# Altium project TEZ_Project.PrjPcb
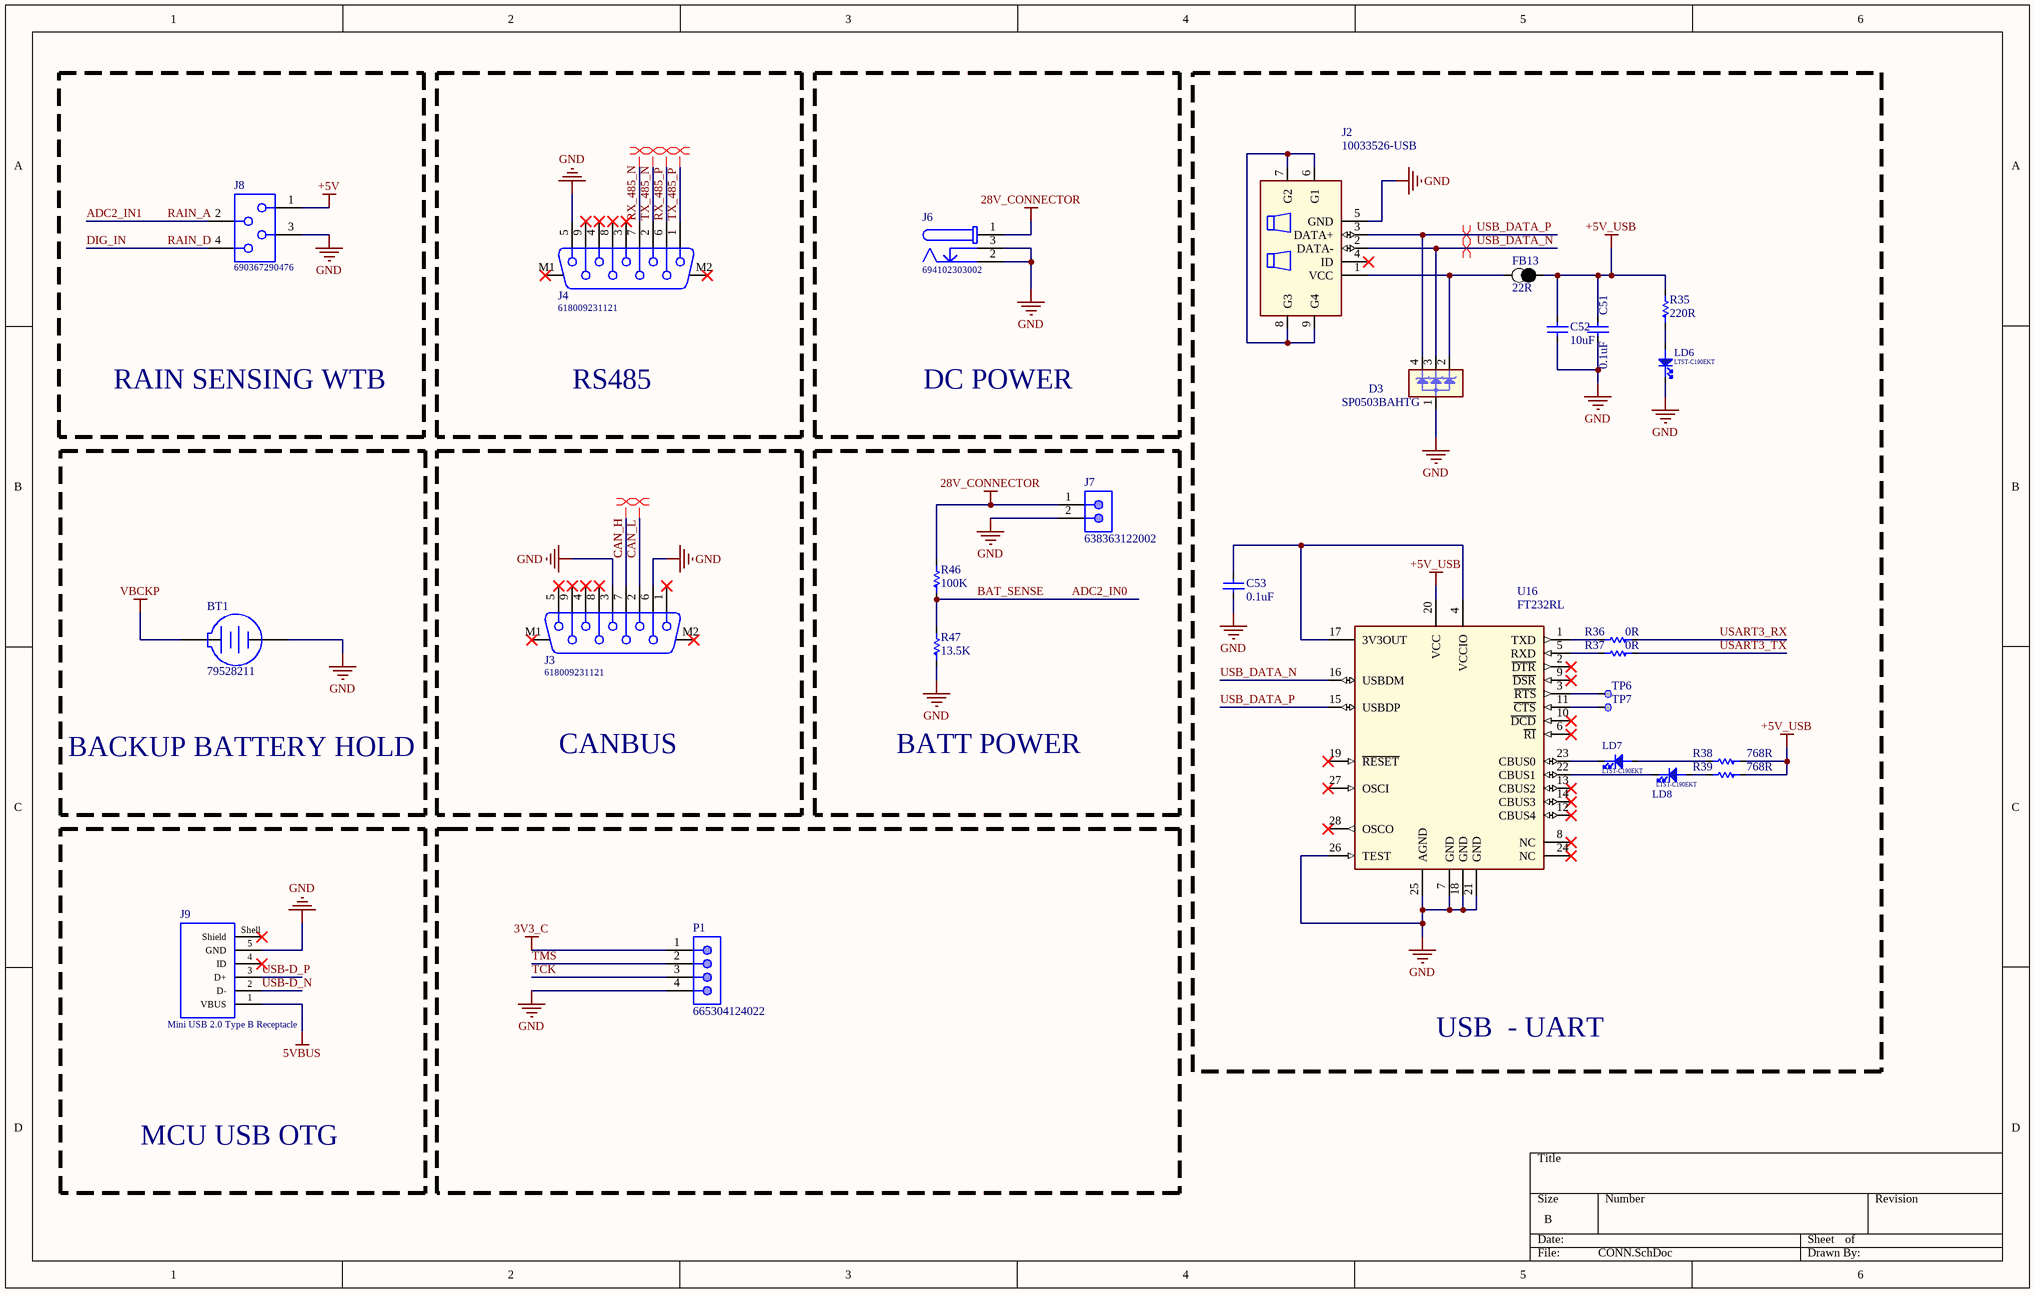
[diagram p0: CONN.SchDoc]
2 sheets, 69 parts. Net scope: global (net labels, ports and power ports of the same name join across sheets).
Board file: TEZ_Project.PcbDoc
Sheets:
  CONN.SchDoc
  DIGITALS.SchDoc

## Sheet CONN.SchDoc
size B; SheetNumber: 4; SheetTotal: 5

### Parts
BT1  79528211  [79528211]
C51  0.1uF  [CAPC1608-0603X85N]
C52  10uF  [CAPC3216-1206X100N]
C53  0.1uF  [CAPC1608-0603X85N]
D3  SP0503BAHTG  [SOT143N]
FB13  22R  [INDC2012-0805X90N]
J2  10033526-USB  [USB/SM0.8-6H5]
J3  618009231121  [618009231121]
J4  618009231121  [618009231121]
J6  694102303002  [694102303002]
J7  638363122002  [638363122002]
J8  690367290476  [690367290476]
J9  Mini USB 2.0 Type B Receptacle  [614105150721]
LD6  LTST-C190EKT  [LED0603-1608X55N-RED]
LD7  LTST-C190EKT  [LED0603-1608X55N-RED]
LD8  LTST-C190EKT  [LED0603-1608X55N-RED]
P1  665304124022  [665304124022]
R35  220R  [RESC1608-0603X50N]
R36  0R  [RESC1608-0603X50N]
R37  0R  [RESC1608-0603X50N]
R38  768R  [RESC2012-0805X50N]
R39  768R  [RESC2012-0805X50N]
R46  100K  [RESC1608-0603X50N]
R47  13.5K  [RESC1608-0603X50N]
TP6  TP  [TP-ROUND]  (value not drawn)  (no BOM)
TP7  TP  [TP-ROUND]  (value not drawn)  (no BOM)
U16  FT232RL  [SSOP65P790-28N]

### Blocks framed on the sheet
RAIN SENSING WTB: J8
RS485: J4
DC POWER: J6
USB  - UART: C51-C53 D3 FB13 J2 LD6-LD8 R35-R39 TP6 TP7 U16
BACKUP BATTERY HOLD: BT1
CANBUS: J3
BATT POWER: J7 R46 R47
MCU USB OTG: J9

### Nets
3V3_C: P1.1
5VBUS: J9.1(VBUS)
28V_CONNECTOR: J6.1 J7.1 R46.2
+5V: J8.1
+5V_USB: C51.1 C52.2 FB13.1 R35.2 R38.1 R39.1 U16.20(VCC)
GND: BT1.2(-) C51.2 C52.1 C53.2 D3.1(A) J2.5(GND) J3.3 J3.6 J4.5 J6.2 J6.3 J7.2 J8.3 J9.5(GND) LD6.2 P1.4 R47.1 U16.7(GND) U16.18(GND) U16.21(GND) U16.25(AGND) U16.26(TEST)
VBCKP: BT1.1(+)
ADC2_IN0: R46.1 R47.2  [also labelled BAT_SENSE]
ADC2_IN1: J8.2  [also labelled RAIN_A]
CAN_H: J3.7
CAN_L: J3.2
DIG_IN: J8.4  [also labelled RAIN_D]
RX_485_N: J4.7
RX_485_P: J4.6
TCK: P1.3
TMS: P1.2
TX_485_N: J4.2
TX_485_P: J4.1
USART3_RX: R36.1
USART3_TX: R37.1
USB-D_N: J9.2(D-)
USB-D_P: J9.3(D+)
USB_DATA_N: D3.3(C2) J2.2(DATA-) U16.16(USBDM)
USB_DATA_P: D3.4(C1) J2.3(DATA+) U16.15(USBDP)
NetC53_1: C53.1 U16.4(VCCIO) U16.17(3V3OUT)
NetD3_2: D3.2(C3) FB13.2 J2.1(VCC)
NetJ2_6: J2.6(G1) J2.7(G2) J2.8(G3) J2.9(G4)
NetLD6_1: LD6.1 R35.1
NetLD7_1: LD7.1 R38.2
NetLD7_2: LD7.2 U16.23(CBUS0)
NetLD8_1: LD8.1 R39.2
NetLD8_2: LD8.2 U16.22(CBUS1)
NetR36_2: R36.2 U16.1(TXD)
NetR37_2: R37.2 U16.5(RXD)
NetTP6_1: TP6.1 U16.3(~{RTS})
NetTP7_1: TP7.1 U16.11(~{CTS})

Not connected (* = marked no-connect by the designer): J2 4(ID)*; J3 1* 4* 5* 8* 9* M1* M2*; J4 3* 4* 8* 9* M1* M2*; J9 4(ID)* Shell(Shield)*; U16 2(~{DTR})* 6(~{RI})* 8(NC)* 9(~{DSR})* 10(~{DCD})* 12(CBUS4)* 13(CBUS2)* 14(CBUS3)* 19(~{RESET})* 24(NC)* 27(OSCI)* 28(OSCO)*

### Layout directives
differential pair: CAN_H, CAN_L, RX_485_N, RX_485_P, TX_485_N, TX_485_P, USB_DATA_N, USB_DATA_P

### Library data of the parts
BT1 = 79528211: WA-BCPH Battery Holder, THT, Battery Type 2025/2032; Manufacturer: Wurth Elektronik; ComponentLink1Description: Manufacturer; ComponentLink1URL: http://www.we-online.de; ComponentLink2Description: Datasheet; ComponentLink2URL: https://www.we-online.com/catalog/datasheet/79528211.pdf; Manufacturer Part Number: 79528211; Mounting Technology: THT; Operating Temperature: -40 to +105degC; Battery Type: 2025/2032; Published Date: July 2021; Packaging: Tray
C51 C53 = Capacitor Ceramic: CAP CER 0.1UF 25V X7R 0603; MANUFACTURER PN: CC0603KRX7R8BB104; MANUFACTURER: Yageo; POPULATED: YES; TOLERANCE: ±10%; VOLTAGE: 25V; PACKAGE: 0603; DIGIKEY PN: 311-1341-1-ND
C52 = Capacitor Ceramic: CAP CER 10UF 16V X7R 1206; MANUFACTURER PN: C3216X7R1C106M160AC; MANUFACTURER: TDK Corporation; POPULATED: YES; TOLERANCE: %10; VOLTAGE: 16V; PACKAGE: 1206; DIGIKEY PN: 445-1601-1-ND
D3 = SP0503BAHTG: 30pF 30kV Unidirectional TVS Array, SP05 Series; MANUFACTURER: LittelFuse; POPULATED: YES; VOLTAGE: up to : 30kV; DIGIKEY PN: F2715CT-ND; PRICE: www.littelfuse.com; MANUFACTURER PN: SP0503BAHTG; PACKAGE: SOT143
FB13 = Inductor EMI suppresion: FERRITE BEAD 22 OHM 0805 1LN; MANUFACTURER: Murata; MANUFACTURER PN: BLM21PG220SN1D; POPULATED: YES; VOLTAGE: 0.8A; TOLERANCE: -55°C ~ 125°C; DIGIKEY PN: 490-5987-1-ND; PACKAGE: 0805
J2 = 10033526-USB: CONN MINI USB RCPT RA TYPE B SMD; MANUFACTURER: Amphenol; MANUFACTURER PN: 10033526-N3212LF; POPULATED: YES; TOLERANCE: 1A; VOLTAGE: 30V; DIGIKEY PN: 609-4700-1-ND; PRICE: 0.71
J3 J4 = 618009231121: WR-DSUB 8.08mm Female PCB Connector with Hex Screw, Angled, 9p; Manufacturer: Wurth Elektronik; Pin Number: 9; Rated Current: 3A; Contact Resistance: 30mOhm; Working Voltage: 125VAC; Withstanding Voltage: 1000VAC; ComponentLink1Description: Manufacturer; ComponentLink1URL: http://www.we-online.de; ComponentLink2Description: Datasheet; ComponentLink2URL: https://www.we-online.com/catalog/datasheet/618009231121.pdf; Manufacturer Part Number: 618009231121; Published Date: April 2021; Type: Angled; Operating Temperature: -55 to +105degC; Mounting Technology: THT; Gender: Female; Packaging: Tray
J6 = 694102303002: WR-DC DC Power Jack Connector, Male, Right Angled, 30V, 2A; Manufacturer: Wurth Elektronik; Plug Outer Diameter: 3.5mm; Opening Diameter: 4.2mm; Plug Inner Diameter: 1.05mm; ComponentLink1Description: Manufacturer; ComponentLink1URL: http://www.we-online.de; ComponentLink2Description: Datasheet; ComponentLink2URL: https://www.we-online.com/catalog/datasheet/694102303002.pdf; Orientation: Right Angled; Published Date: March 2021; Manufacturer Part Number: 694102303002; Mounting Technology: THT; Gender: Male; Packaging: Bag; Operating Temperature: -40 to +85degC; Rated Current: 2A; Working Voltage: 30V
J7 = 638363122002: WR-FAST THT Male Header Angled Blade, pitch 7.62mm, 2p; Contact Resistance: 20mOhm; Pin Number: 2; Rated Current: 16A; Working Voltage: 300VAC; ComponentLink1Description: Manufacturer; ComponentLink1URL: http://www.we-online.de; ComponentLink2Description: Datasheet; ComponentLink2URL: https://katalog.we-online.com/em/datasheet/638363122002.pdf; Packaging: Box; Gender: Male; Part Number: 638363122002; Operating Temperature: -30 to +120degC; Publisher: Wurth Elektronik; Published Date: November 2019; Pitch: 7.62mm; Type: Right Angled; Mounting Technology: THT
J8 = 690367290476: WR-MM Mini Module Connector, Female, SMT, with Latch & Polarization, Straight, 4p; Manufacturer: Wurth Elektronik; Pin Number: 4; Pitch: 2.54mm; Insulation Resistance: 1000MOhm; Rated Current: 1.5A; Working Voltage: 250VAC; Withstanding Voltage: 500VAC; Contact Resistance: 10mOhm; ComponentLink1Description: Manufacturer; ComponentLink1URL: http://www.we-online.de; ComponentLink2Description: Datasheet; ComponentLink2URL: https://www.we-online.com/catalog/datasheet/690367290476.pdf; Manufacturer Part Number: 690367290476; Published Date: September 2021; Operating Temperature: -40 to +105degC; Mounting Technology: SMT; Packaging: Tape and Reel; Gender: Female; Type: Straight; Length: 9.68mm
J9 = 614105150721: Mini USB 2.0 Type B, Receptacle, Vertical, THT; Manufacturer: Wurth Elektronik; Rated Current: 1.8A; Pin Number: 5; Interface Type: Type B; Working Voltage: 30VAC; ComponentLink1Description: Manufacturer; ComponentLink1URL: http://www.we-online.de; ComponentLink2Description: Datasheet; ComponentLink2URL: https://katalog.we-online.com/em/datasheet/614105150721.pdf; Published Date: August 2020; Manufacturer Part Number: 614105150721; Gender: Receptacle; Type: Vertical; Packaging: Tape and Reel; Operating Temperature: -40 to +85degC; Mounting Technology: THT; Application: Mini USB 2.0
LD6-LD8 = LED-0603: LED RED CLEAR CHIP SMD; MANUFACTURER: Lite-On Inc; POPULATED: YES; VOLTAGE: 2V; PACKAGE: LED-0603; MANUFACTURER PN: LTST-C190EKT; DIGIKEY PN: 160-1182-1-ND
P1 = 665304124022: WR-WTB SMT Male Vertical Shrouded Header, pitch 1mm, 4p; Pin Number: 4; Contact Resistance: 20mOhm; Rated Current: 1A; Withstanding Voltage: 500VAC; Working Voltage: 50VAC; ComponentLink1Description: Manufacturer; ComponentLink1URL: http://www.we-online.de; ComponentLink2Description: Datasheet; ComponentLink2URL: https://www.we-online.com/catalog/datasheet/665304124022.pdf; Pitch: 1mm; Published Date: January 2020; Publisher: Wurth Elektronik; Mounting Technology: SMT; Packaging: Tape and Reel; Operating Temperature: -25 to +85degC; Part Number: 665304124022; Gender: Male; Type: Vertical
R35 = Resistor SMD: RES SMD 220 OHM 5% 1/10W 0603; MANUFACTURER: Yageo; MANUFACTURER PN: RC0603JR-07220RL; POPULATED: YES; TOLERANCE: %1; DIGIKEY PN: 311-220GRCT-ND; PACKAGE: 0603
R36 R37 = Resistor SMD: RES SMD 0 OHM JUMPER 1/10W 0603; MANUFACTURER: Yageo; MANUFACTURER PN: RC0603JR-070RL; POPULATED: YES; TOLERANCE: ±1%; DIGIKEY PN: 311-0.0GRCT-ND; PACKAGE: 0603
R38 R39 = Resistor SMD: RES SMD 768 OHM 1% 1/8W 0805; MANUFACTURER: YAGEO; MANUFACTURER PN: RC0805FR-07768RL; POPULATED: YES; VOLTAGE: 0.125W, 1/8W; PRICE: 0.1; PACKAGE: 0805; TOLERANCE: ±1%; DIGIKEY PN: 311-768CRCT-ND
R46 R47 = RESISTOR 10K: RES SMD 10K OHM 1% 1/10W 0603; MANUFACTURER: Yageo; MANUFACTURER PN: RC0603FR-0710KL; POPULATED: YES; ANTSIS STOK PN: R10K006030101; ASSEMBLY: Auto; DIGIKEY PN: ANTSIS_STOK; PACKAGE: 0603
TP6 TP7 = TP: Test point; Populated: YES; Assembly Method: Manual
U16 = FT232RL: USB FS SERIAL UART; Manufacturer: FTDI; Tolerance: -40 to +85C; Voltage: +3.3V to +5.25V; Populated: YES; Assembly Method: Auto; Datasheet Link: www.ftdichip.com/Support/Documents/DataSheets/ICs/DS_FT232R.pdf; package Type: SSOP-28; Manufacturer PN: FT232RL; DIGIKEY PN: 768-1306-ND

## Sheet DIGITALS.SchDoc
size B; SheetNumber: 2; SheetTotal: 5
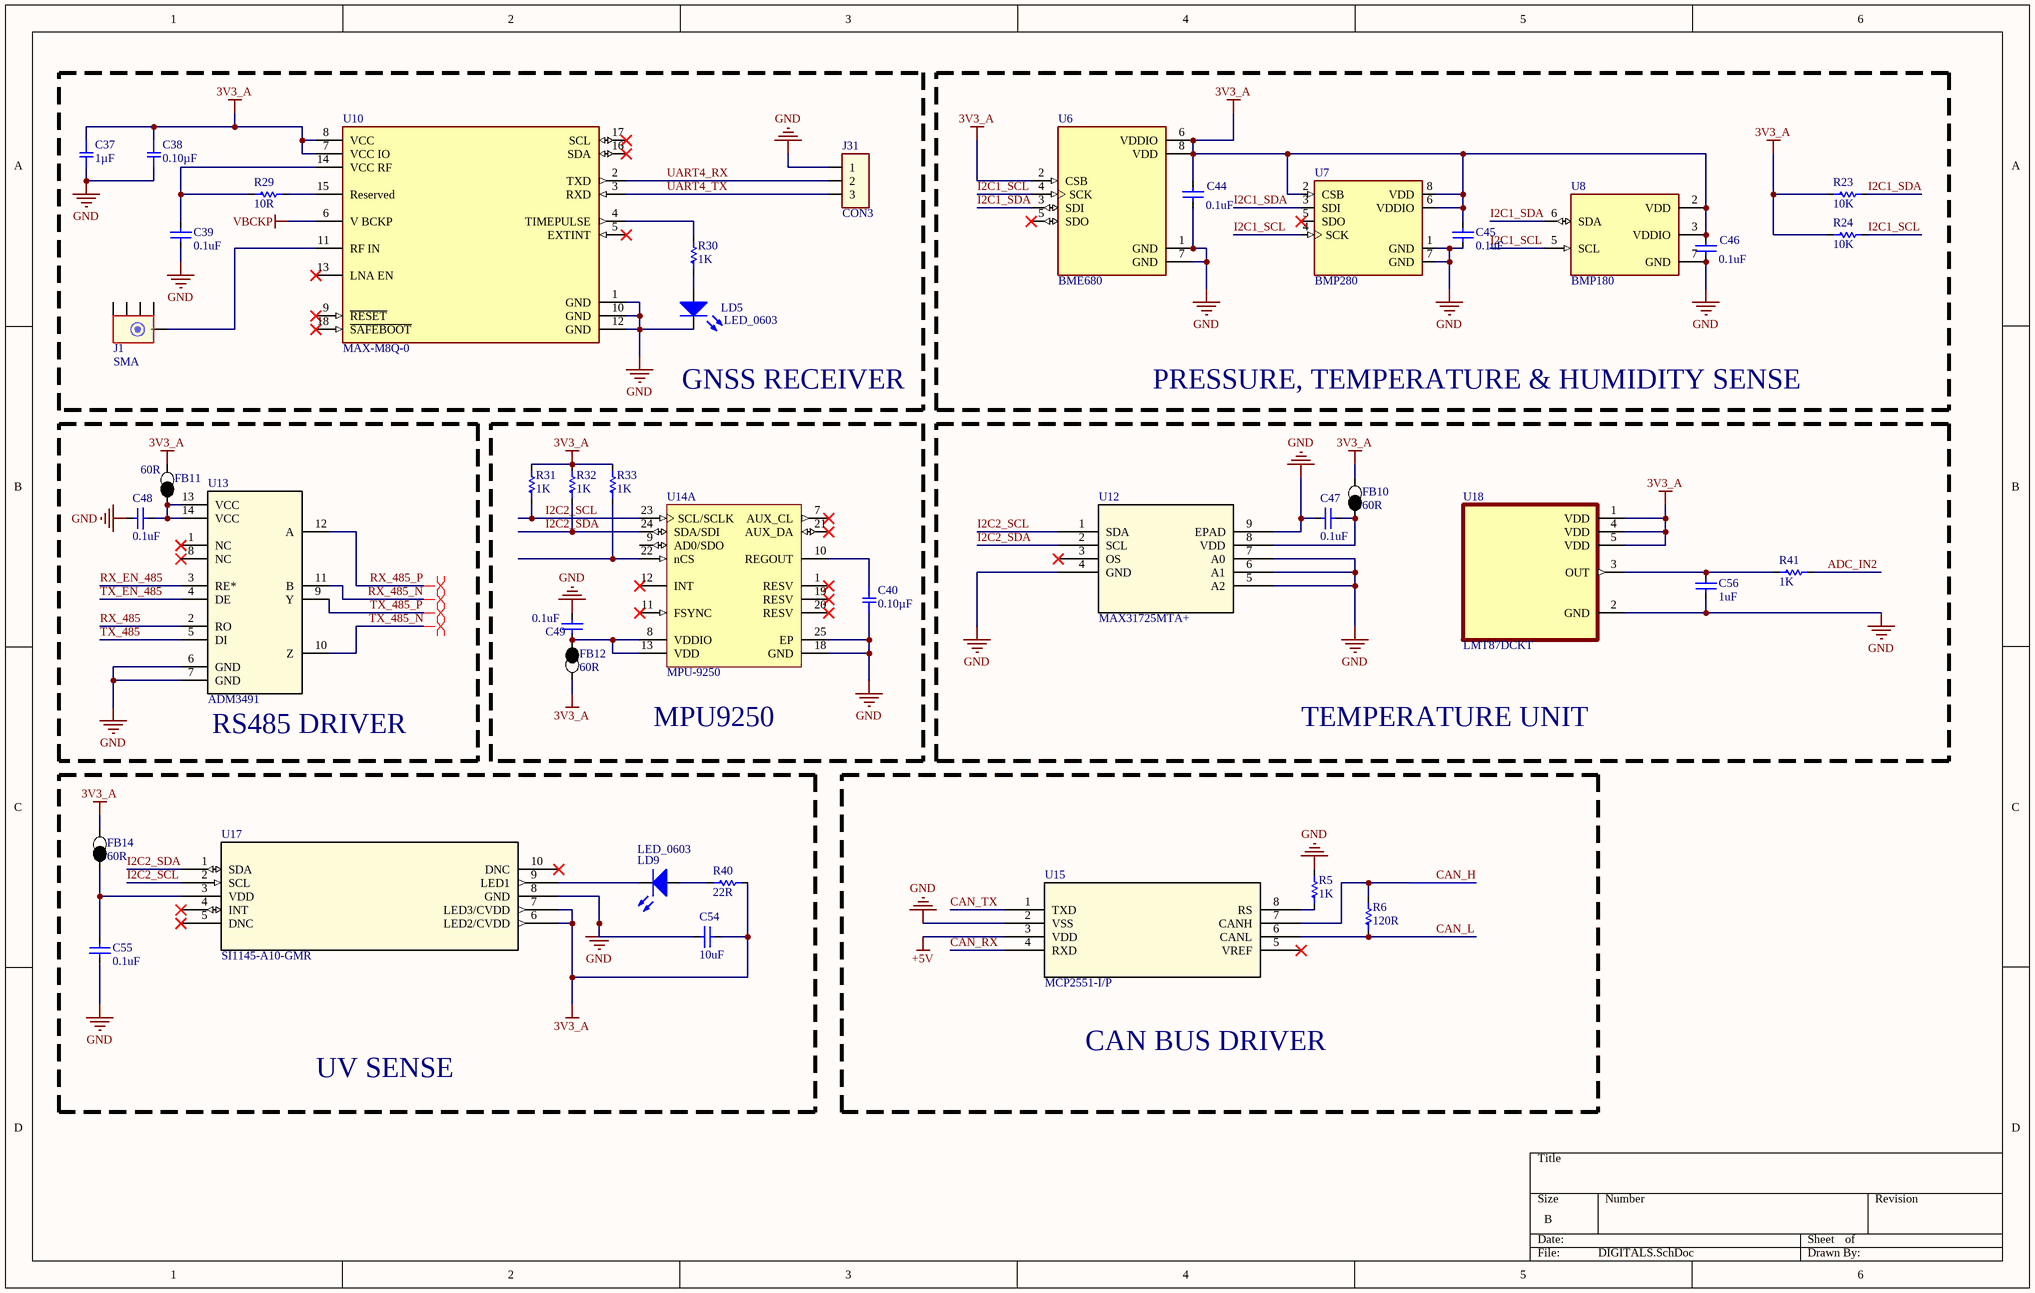
[diagram p1: DIGITALS.SchDoc]

### Parts
C37  1µF  [SMD-0603C]
C38  0.10µF  [SMD-0603C]
C39  0.1uF  [CAPC1608-0603X90N]
C40  0.10µF  [SMD-0603C]
C44  0.1uF  [CAPC1608-0603X90N]
C45  0.1uF  [CAPC1608-0603X90N]
C46  0.1uF  [CAPC1608-0603X90N]
C47  0.1uF  [CAPC1608-0603X90N]
C48  0.1uF  [CAPC1608-0603X90N]
C49  0.1uF  [CAPC1608-0603X90N]
C54  10uF  [CAPC1608-0603X90N]
C55  0.1uF  [CAPC1608-0603X90N]
C56  1uF  [CAPC1608-0603X90N]
FB10  60R  [INDC1608-0603X80N]
FB11  60R  [INDC1608-0603X80N]
FB12  60R  [INDC1608-0603X80N]
FB14  60R  [INDC1608-0603X80N]
J1  SMA  [HUBER-SUHNER_85 SMA-50-0-101/111 NE]
J31  CON3  [HDR1X3M]
LD5  LED_0603  [LED0603-1608X55N-GREEN]
LD9  LED_0603  [LED0603-1608X55N-GREEN]
R5  1K  [RESC1608-0603X50N]
R6  120R  [RESC1608-0603X50N]
R23  10K  [RESC1608-0603X50N]
R24  10K  [RESC1608-0603X50N]
R29  10R  [RESC1608-0603X50N]
R30  1K  [RESC1608-0603X50N]
R31  1K  [RESC1608-0603X50N]
R32  1K  [RESC1608-0603X50N]
R33  1K  [RESC1608-0603X50N]
R40  22R  [RESC1608-0603X50N]
R41  1K  [RESC1608-0603X50N]
U6  BME680  [PSON80P300X300X100-8N]
U7  BMP280  [XDCR_BMP280]
U8  BMP180  [BMP180]
U10  MAX-M8Q-0  [FP-MAX-M8Q-0-MFG]
U12  MAX31725MTA+  [SON65P300X300X80-9N]
U13  ADM3491  [SOIC127P600-14N]
U14  MPU-9250  [INSE-QFN-24-1700X1540TP_N]  (part A of 2)
U15  MCP2551-I/P  [PDIP8_300MC_MCH]
U17  SI1145-A10-GMR  [QFN10_2X2_SIL]
U18  LMT87DCKT  [SOT65P210X110-5N]

### Blocks framed on the sheet
GNSS RECEIVER: C37-C39 J1 J31 LD5 R29 R30 U10
RS485 DRIVER: C48 FB11 U13
MPU9250: C40 C49 FB12 R31-R33 U14
UV SENSE: C54 C55 FB14 LD9 R40 U17
CAN BUS DRIVER: R5 R6 U15

### Nets
3V3_A: C37.1 C38.1 C44.2 C45.2 C46.2 C54.1 FB10.2 FB11.2 FB12.2 FB14.2 R23.1 R24.1 R31.2 R32.2 R33.2 R40.2 U6.2(CSB) U6.6(VDDIO) U6.8(VDD) U7.2(CSB) U7.6(VDDIO) U7.8(VDD) U8.2(VDD) U8.3(VDDIO) U10.7(VCC_IO) U10.8(VCC) U17.6(LED2/CVDD) U17.7(LED3/CVDD) U18.1(VDD) U18.4(VDD) U18.5(VDD)
+5V: U15.3(VDD)
GND: C37.2 C38.2 C39.1 C40.2 C44.1 C45.1 C46.1 C47.2 C48.1 C49.2 C54.2 C55.2 C56.1 J31.1 LD5.2(K) R5.2 U6.1(GND) U6.7(GND) U7.1(GND) U7.7(GND) U8.7(GND) U10.1(GND) U10.10(GND) U10.12(GND) U12.4(GND) U12.5(A2) U12.6(A1) U12.7(A0) U12.9(EPAD) U13.6(GND) U13.7(GND) U14.18(GND) U14.25(EP) U15.2(VSS) U17.8(GND) U18.2(GND)
VBCKP: U10.6(V_BCKP)
ADC_IN2: R41.2
CAN_H: R6.2 U15.7(CANH)
CAN_L: R6.1 U15.6(CANL)
CAN_RX: U15.4(RXD)
CAN_TX: U15.1(TXD)
I2C1_SCL: R24.2 U6.4(SCK) U7.4(SCK) U8.5(SCL)
I2C1_SDA: R23.2 U6.3(SDI) U7.3(SDI) U8.6(SDA)
I2C2_SCL: R31.1 U12.1(SDA) U14.23(SCL/SCLK) U17.2(SCL)
I2C2_SDA: R32.1 U12.2(SCL) U14.24(SDA/SDI) U17.1(SDA)
RX_485: U13.2(RO)
RX_485_N: U13.11(B)
RX_485_P: U13.12(A)
RX_EN_485: U13.3(RE*)
TX_485: U13.5(DI)
TX_485_N: U13.10(Z)
TX_485_P: U13.9(Y)
TX_EN_485: U13.4(DE)
UART4_RX: J31.2 U10.2(TXD)
UART4_TX: J31.3 U10.3(RXD)
NetC39_2: C39.2 R29.1 U10.14(VCC_RF)
NetC40_1: C40.1 U14.10(REGOUT)
NetC47_1: C47.1 FB10.1 U12.8(VDD)
NetC48_2: C48.2 FB11.1 U13.13(VCC) U13.14(VCC)
NetC49_1: C49.1 FB12.1 U14.8(VDDIO) U14.13(VDD)
NetC55_1: C55.1 FB14.1 U17.3(VDD)
NetC56_2: C56.2 R41.1 U18.3(OUT)
NetJ1_1: J1.1 U10.11(RF_IN)
NetLD5_1: LD5.1(A) R30.1
NetLD9_1: LD9.1(A) R40.1
NetLD9_2: LD9.2(K) U17.9(LED1)
NetR5_1: R5.1 U15.8(RS)
NetR29_2: R29.2 U10.15(Reserved)
NetR30_2: R30.2 U10.4(TIMEPULSE)
NetR33_1: R33.1 U14.22(nCS)

Not connected (* = marked no-connect by the designer): J1 2 3 4 5; U6 5(SDO)*; U7 5(SDO)*; U10 5(EXTINT)* 9(~{RESET})* 13(LNA_EN)* 16(SDA)* 17(SCL)* 18(~{SAFEBOOT})*; U12 3(OS)*; U13 1(NC)* 8(NC)*; U14 1(RESV)* 7(AUX_CL)* 9(AD0/SDO) 11(FSYNC)* 12(INT)* 19(RESV)* 20(RESV)* 21(AUX_DA)*; U15 5(VREF)*; U17 4(INT)* 5(DNC)* 10(DNC)*

### Layout directives
differential pair: RX_485_N, RX_485_P, TX_485_N, TX_485_P

### Notes on the sheet
- PRESSURE, TEMPERATURE & HUMIDITY SENSE
- TEMPERATURE UNIT

### Library data of the parts
C37 = GRT188R61E105KE13D: CAP CER 1UF 25V X5R 0603; Manufacturer: Murata Electronics North America; Factory Stock: 0; Unit Price (USD): 0.14; Minimum Quantity: 1; Tolerance: ±10%; Datasheets: http://search.murata.co.jp/Ceramy/image/img/A01X/G101/ENG/GRT188R61E105KE13-01.pdf; Image: //media.digikey.com/Renders/Murata%20Renders/0603%28LQG18%29.jpg; Digi-Key Part Number: 490-12321-1-ND; Part Number: GRT188R61E105KE13D; Quantity Available: 3746; @ qty: 0; Packaging: Cut Tape (CT); Series: GRT; Part Status: Active; Value: 1µF; Voltage: 25V; Temperature Coefficient: X5R; Operating Temperature: -55°C ~ 85°C; Features: -; Ratings: AEC-Q200; Applications: Automotive; Mounting Type: Surface Mount, MLCC; Package / Case: 0603 (1608 Metric); Size / Dimension: 0.063" L x 0.031" W (1.60mm x 0.80mm); Height - Seated (Max): -; Thickness (Max): 0.035" (0.90mm); Lead Spacing: -; Lead Style: -
C38 = GCJ188R71H104KA12D: CAP CER 0.1UF 50V X7R 0603; Manufacturer: Murata Electronics North America; Factory Stock: 0; Unit Price (USD): 0.12; Minimum Quantity: 1; Tolerance: ±10%; Datasheets: http://www.murata.com/~/media/webrenewal/support/library/catalog/products/capacitor/mlcc/c03e.ashx; Image: //media.digikey.com/Renders/Murata%20Renders/0603%28LQG18%29.jpg; Digi-Key Part Number: 490-5798-1-ND; Part Number: GCJ188R71H104KA12D; Quantity Available: 163695; @ qty: 0; Packaging: Cut Tape (CT); Series: GCJ; Part Status: Active; Value: 0.10µF; Voltage: 50V; Temperature Coefficient: X7R; Operating Temperature: -55°C ~ 125°C; Features: Soft Termination; Ratings: AEC-Q200; Applications: Automotive, Boardflex Sensitive; Mounting Type: Surface Mount, MLCC; Package / Case: 0603 (1608 Metric); Size / Dimension: 0.063" L x 0.031" W (1.60mm x 0.80mm); Height - Seated (Max): -; Thickness (Max): 0.035" (0.90mm); Lead Spacing: -; Lead Style: -
C39 C44-C49 C55 = CAP 0.1uF: CAP CER 0.1UF 50V X7R 0603; MANUFACTURER PN: CL10B104KB8NNNC; MANUFACTURER: Samsung Electro-Mechanics; POPULATED: YES; TOLERANCE: 10%; ANTSIS STOK PN: C0U106031050; ASSEMBLY: Auto; VOLTAGE: 50V; PACKAGE: 0603; DIGIKEY PN: ANTSIS_STOK
C40 = GCJ188R71C104KA01D: CAP CER 0.1UF 16V X7R 0603; Manufacturer: Murata Electronics North America; Factory Stock: 0; Unit Price (USD): 0.21; Minimum Quantity: 1; Tolerance: ±10%; Datasheets: http://www.murata.com/~/media/webrenewal/support/library/catalog/products/capacitor/mlcc/c03e.ashx; Image: //media.digikey.com/Renders/Murata%20Renders/0603%28LQG18%29.jpg; Digi-Key Part Number: 490-5796-1-ND; Part Number: GCJ188R71C104KA01D; Quantity Available: 22473; @ qty: 0; Packaging: Cut Tape (CT); Series: GCJ; Part Status: Active; Value: 0.10µF; Voltage: 16V; Temperature Coefficient: X7R; Operating Temperature: -55°C ~ 125°C; Features: Soft Termination; Ratings: AEC-Q200; Applications: Automotive, Boardflex Sensitive; Mounting Type: Surface Mount, MLCC; Package / Case: 0603 (1608 Metric); Size / Dimension: 0.063" L x 0.031" W (1.60mm x 0.80mm); Height - Seated (Max): -; Thickness (Max): 0.035" (0.90mm); Lead Spacing: -; Lead Style: -
C54 = CAP 10uF: CAP CER 10UF 10V X5R 0603; MANUFACTURER PN: CL10A106MP8NNNC; MANUFACTURER: Samsung Electro-Mechanics; POPULATED: YES; TOLERANCE: 20%; ANTSIS STOK PN: C10U006032010; ASSEMBLY: Auto; VOLTAGE: 10V; PACKAGE: 0603; DIGIKEY PN: ANTSIS_STOK
C56 = CAP 1uF: CAP CER 1UF 25V X7R 0603; MANUFACTURER PN: CL10B105KA8NNNC; MANUFACTURER: Samsung Electro-Mechanics; POPULATED: YES; TOLERANCE: 10%; ANTSIS STOK PN: C1U006031050; ASSEMBLY: Auto; VOLTAGE: 25V; PACKAGE: 0603; DIGIKEY PN: ANTSIS_STOK
FB10-FB12 FB14 = FERRITE 60R 3A: FERRITE BEAD 60 OHM 0603 1LN; MANUFACTURER: Würth Elektronik; MANUFACTURER PN: 742792602; POPULATED: YES; TOLERANCE: -55°C ~ 125°C; VOLTAGE: 3A; ANTSIS STOK PN: F60R00603xx03; ASSEMBLY: Auto; DIGIKEY PN: ANTSIS_STOK; PACKAGE: 0603
J1 = SMA: POPULATED: YES; ASSEMBLY: Manuel
J31 = CON3: POPULATED: YES; ASSEMBLY: Manuel
LD5 LD9 = LED_0603: LED GREEN CLEAR CHIP SMD; MANUFACTURER: Lite-On Inc.; MANUFACTURER PN: LTST-C190GKT; POPULATED: YES; VOLTAGE: 2.1V; ANTSIS STOK PN: LDGRN6032V1; ASSEMBLY: Auto; PACKAGE: LED-0603; DIGIKEY PN: ANTSIS_STOK
R5 R23 R24 = RESISTOR 10K: as R46 on sheet CONN; DIGIKEY PN: ANTSIS_STOK; PACKAGE: 0603
R6 = RESISTOR 0R: RES SMD 0 OHM JUMPER 1/10W 0603; MANUFACTURER: Yageo; MANUFACTURER PN: RC0603FR-070RL; POPULATED: YES; ANTSIS STOK PN: R0R00603XX01; ASSEMBLY: Auto; DIGIKEY PN: ANTSIS_STOK; PACKAGE: 0603
R29 = RESISTOR 10K: RES SMD 10 OHM 1% 1/10W 0603; MANUFACTURER: Yageo; MANUFACTURER PN: RC0603FR-0710KL; POPULATED: YES; ANTSIS STOK PN: R10K006030101; ASSEMBLY: Auto; DIGIKEY PN: ANTSIS_STOK; PACKAGE: 0603
R30-R33 R41 = RESISTOR 1K: RES SMD 1K OHM 1% 1/10W 0603; MANUFACTURER: Yageo; MANUFACTURER PN: RC0603FR-071KL; POPULATED: YES; ANTSIS STOK PN: R1K006030101; ASSEMBLY: Auto; DIGIKEY PN: ANTSIS_STOK; PACKAGE: 0603
R40 = RESISTOR 22R: RES 22 OHM 5% 1/10W 0603; MANUFACTURER: Stackpole Electronics Inc; MANUFACTURER PN: RMCF0603JT22R0; POPULATED: YES; ANTSIS STOK PN: R22R006030501; ASSEMBLY: Auto; DIGIKEY PN: ANTSIS_STOK; PACKAGE: 0603; TOLERANCE: 5%
U6 = BME680: Gas, Humidity, Pressure, Temperature Sensor IÂ²C, SPI Output; MF: Bosch Sensortec; Package: LGA-8 Bosch Tools; MP: BME680; Value: *; Availability: Unavailable; Price: None; SnapEDA_Link: https://www.snapeda.com/parts/BME680/Bosch%20Sensortec/view-part/947201/?ref=snap
U7 = BMP280: Pressure Sensor 4.35PSI ~ 15.95PSI _30kPa ~ 110kPa_ Absolute 16b 8-SMD; MF: Bosch; SnapEDA_Link: https://www.snapeda.com/parts/BMP280/Bosch%20Sensortec/view-part/1186631/?ref=snap; Package: SMD-8 Bosch Sensortec; MP: BMP280; Value: *; Digi-Key_Part_Number: 828-1064-1-ND; Digi-Key_Purchase_URL: https://www.digikey.com/product-detail/en/bosch-sensortec/BMP280/828-1064-1-ND/6136315?utm_source=snapeda&utm_medium=aggregator&utm_campaign=symbol
U8 = BMP180: Pressure Sensor 4.35PSI ~ 15.95PSI _30kPa ~ 110kPa_ Absolute 16 ~ 19 b 7-VLGA; MF: Bosch Sensortec; Digi-Key_Purchase_URL: https://www.digikey.com/product-detail/en/bosch-sensortec/BMP180/828-1027-1-ND/2688260?utm_source=snapeda&utm_medium=aggregator&utm_campaign=symbol; Digi-Key_Part_Number: 828-1027-1-ND; Package: VLGA-7 Bosch Sensortec; SnapEDA_Link: https://www.snapeda.com/parts/BMP180/Bosch%20Sensortec/view-part/587596/?ref=snap; Value: *; MP: BMP180
U10 = CMP-207130-000017-1: RF RCVR GNSS/GPS 1.575GHZ 18LCC; Sensitivity: -167dBm; Current - Receiving: 23mA; Interface: I2C; Frequency: 1.575GHz; Min Operating Temperature: -40°C; Case/Package: SMD/SMT; RoHS Compliant: Yes; Packaging: Cut Tape; Max Operating Temperature: 85°C
U12 = MAX31725MTA+: No Description Available; Mfr_Name: Maxim Integrated Products; Copyright: Copyright (C) 2021 Ultra Librarian. All rights reserved.; Manufacturer_Part_Number: MAX31725MTA+; Digi-Key_Part_Number_1: MAX31725MTA+-ND; RefDes: RefDes; Type: DEV
U13 = ADM3491: 1/1 Transceiver Full RS422, RS485 14-SOIC; MANUFACTURER: Analog Devices Inc.; MANUFACTURER PN: ADM3491ARZ-REEL7; VOLTAGE: 3V ~ 3.6V; TOLERANCE: -40°C ~ 85°C; POPULATED: YES; ASSEMBLY: Manuel; DIGIKEY PN: ADM3491ARZ-REEL7CT-ND; PACKAGE: 14SOIC
U14 = CMP-2100-03657-1: 9-axis MotionTracking device, 2.4 to 3,6 V, -40 to 85 degC, 24-Pin QFN, RoHS, Tape and Reel; Manufacturer: InvenSense; Max Supply Voltage: 3.6V; Min Supply Voltage: 2.4V; Package Reference: QFN-24; Package Quantity: 1; Datasheet Version: Rev. 1.0, 01/2014; Case/Package: QFN; Package Description: 24-Pin Quad Flat No-lead Package, Body 3 x 3 mm, Pitch 0.4 mm; Datasheet URL: http://datasheet.octopart.com/MPU-9250-InvenSense-datasheet-21859386.pdf; RoHSCompliant: true; Max Operating Temperature: 85degC; Height: 1mm; Mount: SurfaceMount; Manufacturer URL: http://www.invensense.com/; Width: 3.1mm; Min Operating Temperature: -40degC; Length: 3.1mm
U15 = MCP2551-I/P: No Description Available; Mfr_Name: Microchip; Copyright: Copyright (C) 2021 Ultra Librarian. All rights reserved.; Manufacturer_Part_Number: MCP2551-I/P; RefDes: RefDes; Type: DEV
U17 = SI1145-A10-GMR: No Description Available; Mfr_Name: Silicon Labs; Copyright: Copyright (C) 2021 Ultra Librarian. All rights reserved.; Manufacturer_Part_Number: SI1145-A10-GMR; Digi-Key_Part_Number_1: 336-2622-1-ND; Digi-Key_Part_Number_2: 336-2622-2-ND; Digi-Key_Part_Number_3: 336-2622-6-ND; RefDes: RefDes; Type: DEV
U18 = LMT87DCKT: 2C 2.7V to 5.5V analog output temperature sensor with -13.6 mV/C gain 5-SC70 -50 to 150; MF: Texas Instruments; Price: None; MP: LMT87DCKT; Purchase-URL: https://pricing.snapeda.com/search/part/LMT87DCKT/?ref=eda; SnapEDA_Link: https://www.snapeda.com/parts/LMT87DCKT/Texas%20Instruments/view-part/2598127/?ref=snap; Availability: Good; Package: SOT-SC70-5 Texas Instruments; Value: *

## Nets that join several sheets
+5V: CONN (J8.1), DIGITALS (U15.3)
GND: CONN (22 pins), DIGITALS (36 pins)
VBCKP: CONN (BT1.1), DIGITALS (U10.6)
CAN_H: CONN (J3.7), DIGITALS (R6.2 U15.7)
CAN_L: CONN (J3.2), DIGITALS (R6.1 U15.6)
RX_485_N: CONN (J4.7), DIGITALS (U13.11)
RX_485_P: CONN (J4.6), DIGITALS (U13.12)
TX_485_N: CONN (J4.2), DIGITALS (U13.10)
TX_485_P: CONN (J4.1), DIGITALS (U13.9)